# Altium schematic sheet rad_detector_v500_MAIN.SchDoc
size A4; SheetNumber: 1; SheetTotal: 7
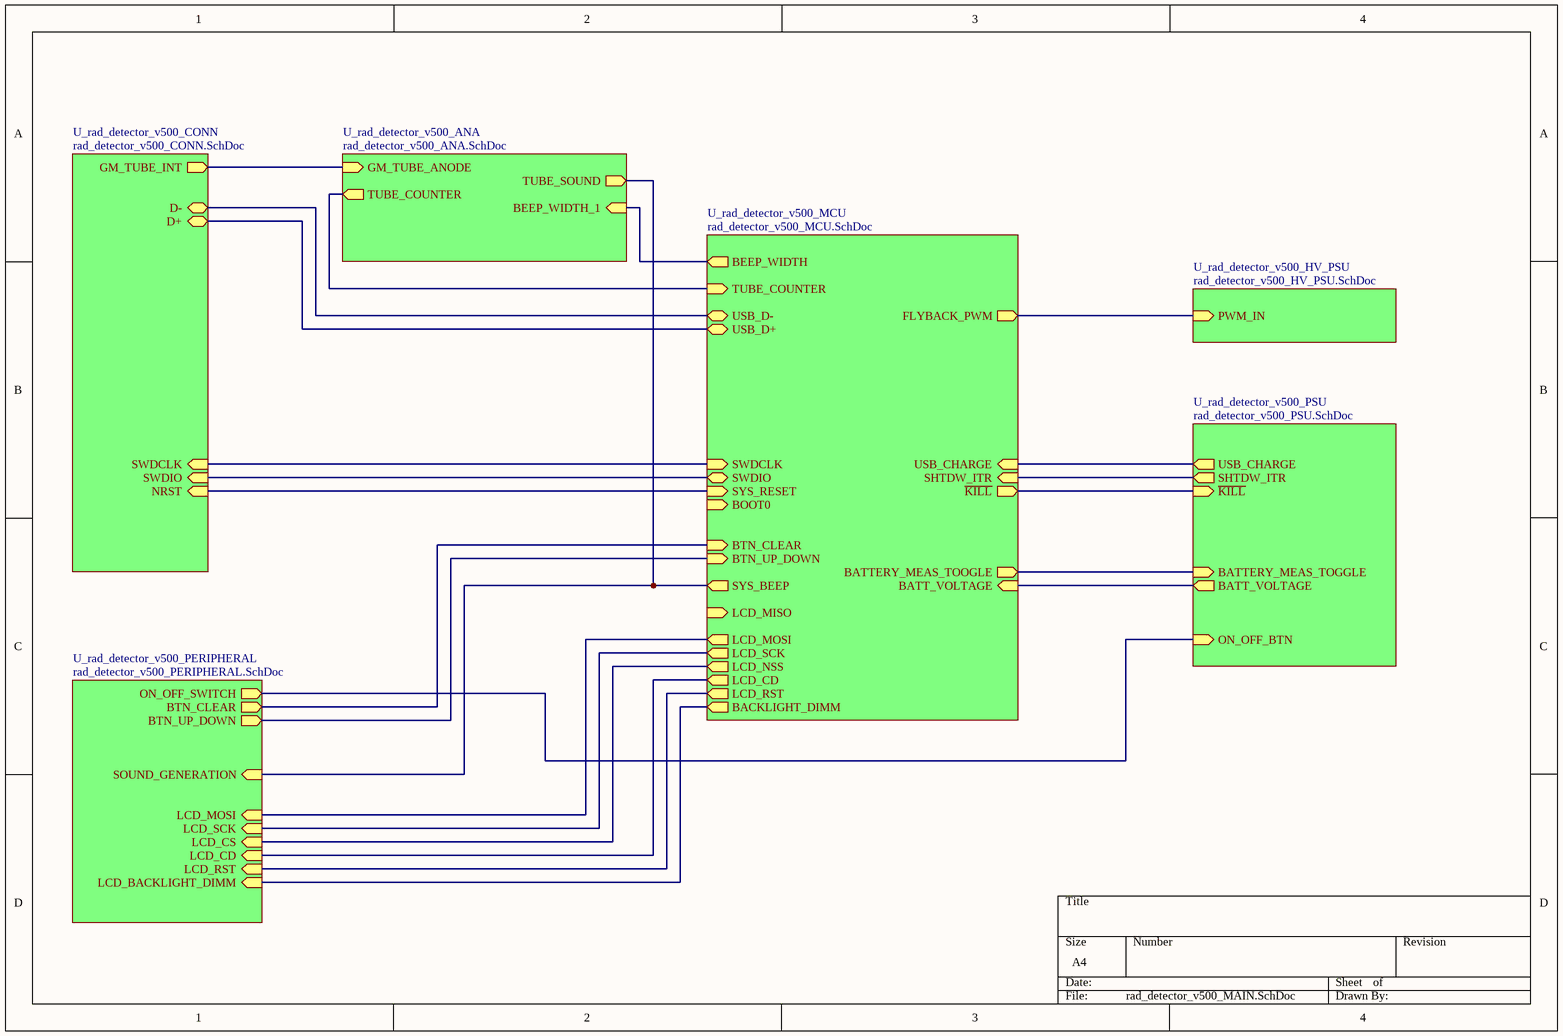
[diagram p0: rad_detector_v500_MAIN.SchDoc]

## Sub-sheets
U_rad_detector_v500_ANA = rad_detector_v500_ANA.SchDoc: GM_TUBE_ANODE (in), BEEP_WIDTH_1 (in), TUBE_COUNTER (out), TUBE_SOUND (out)
U_rad_detector_v500_CONN = rad_detector_v500_CONN.SchDoc: GM_TUBE_INT (out), D- (bidir), D+ (bidir), NRST (in), SWDCLK (in), SWDIO (in)
U_rad_detector_v500_HV_PSU = rad_detector_v500_HV_PSU.SchDoc: PWM_IN (in)
U_rad_detector_v500_MCU = rad_detector_v500_MCU.SchDoc: SYS_BEEP (out), BOOT0 (in), SYS_RESET (in), SWDIO (bidir), SWDCLK (in), USB_CHARGE (in), BATTERY_MEAS_TOOGLE (out), FLYBACK_PWM (out), SHTDW_ITR (in), TUBE_COUNTER (in), BACKLIGHT_DIMM (out), LCD_RST (out), LCD_MOSI (out), LCD_MISO (in), LCD_SCK (out), LCD_NSS (out), USB_D- (bidir), USB_D+ (bidir), BTN_CLEAR (in), BTN_UP_DOWN (in), BATT_VOLTAGE (in), BEEP_WIDTH (out), ~{KILL} (out), LCD_CD (out)
U_rad_detector_v500_PERIPHERAL = rad_detector_v500_PERIPHERAL.SchDoc: SOUND_GENERATION (in), LCD_BACKLIGHT_DIMM (in), LCD_MOSI (in), LCD_SCK (in), LCD_CS (in), LCD_CD (in), LCD_RST (in), ON_OFF_SWITCH (out), BTN_CLEAR (out), BTN_UP_DOWN (out)
U_rad_detector_v500_PSU = rad_detector_v500_PSU.SchDoc: ON_OFF_BTN (in), SHTDW_ITR (out), USB_CHARGE (out), BATTERY_MEAS_TOGGLE (in), BATT_VOLTAGE (out), ~{KILL} (in)

## Nets
(unnamed): sheet U_rad_detector_v500_CONN/GM_TUBE_INT, sheet U_rad_detector_v500_ANA/GM_TUBE_ANODE
(unnamed): sheet U_rad_detector_v500_CONN/D-, sheet U_rad_detector_v500_MCU/USB_D-
(unnamed): sheet U_rad_detector_v500_CONN/D+, sheet U_rad_detector_v500_MCU/USB_D+
(unnamed): sheet U_rad_detector_v500_CONN/NRST, sheet U_rad_detector_v500_MCU/SYS_RESET
(unnamed): sheet U_rad_detector_v500_CONN/SWDCLK, sheet U_rad_detector_v500_MCU/SWDCLK
(unnamed): sheet U_rad_detector_v500_CONN/SWDIO, sheet U_rad_detector_v500_MCU/SWDIO
(unnamed): sheet U_rad_detector_v500_PERIPHERAL/SOUND_GENERATION, sheet U_rad_detector_v500_ANA/TUBE_SOUND, sheet U_rad_detector_v500_MCU/SYS_BEEP
(unnamed): sheet U_rad_detector_v500_PERIPHERAL/LCD_BACKLIGHT_DIMM, sheet U_rad_detector_v500_MCU/BACKLIGHT_DIMM
(unnamed): sheet U_rad_detector_v500_PERIPHERAL/LCD_MOSI, sheet U_rad_detector_v500_MCU/LCD_MOSI
(unnamed): sheet U_rad_detector_v500_PERIPHERAL/LCD_SCK, sheet U_rad_detector_v500_MCU/LCD_SCK
(unnamed): sheet U_rad_detector_v500_PERIPHERAL/LCD_CS, sheet U_rad_detector_v500_MCU/LCD_NSS
(unnamed): sheet U_rad_detector_v500_PERIPHERAL/LCD_CD, sheet U_rad_detector_v500_MCU/LCD_CD
(unnamed): sheet U_rad_detector_v500_PERIPHERAL/LCD_RST, sheet U_rad_detector_v500_MCU/LCD_RST
(unnamed): sheet U_rad_detector_v500_PERIPHERAL/ON_OFF_SWITCH, sheet U_rad_detector_v500_PSU/ON_OFF_BTN
(unnamed): sheet U_rad_detector_v500_PERIPHERAL/BTN_CLEAR, sheet U_rad_detector_v500_MCU/BTN_CLEAR
(unnamed): sheet U_rad_detector_v500_PERIPHERAL/BTN_UP_DOWN, sheet U_rad_detector_v500_MCU/BTN_UP_DOWN
(unnamed): sheet U_rad_detector_v500_ANA/BEEP_WIDTH_1, sheet U_rad_detector_v500_MCU/BEEP_WIDTH
(unnamed): sheet U_rad_detector_v500_ANA/TUBE_COUNTER, sheet U_rad_detector_v500_MCU/TUBE_COUNTER
(unnamed): sheet U_rad_detector_v500_HV_PSU/PWM_IN, sheet U_rad_detector_v500_MCU/FLYBACK_PWM
(unnamed): sheet U_rad_detector_v500_PSU/SHTDW_ITR, sheet U_rad_detector_v500_MCU/SHTDW_ITR
(unnamed): sheet U_rad_detector_v500_PSU/USB_CHARGE, sheet U_rad_detector_v500_MCU/USB_CHARGE
(unnamed): sheet U_rad_detector_v500_PSU/BATTERY_MEAS_TOGGLE, sheet U_rad_detector_v500_MCU/BATTERY_MEAS_TOOGLE
(unnamed): sheet U_rad_detector_v500_PSU/BATT_VOLTAGE, sheet U_rad_detector_v500_MCU/BATT_VOLTAGE
(unnamed): sheet U_rad_detector_v500_PSU/~{KILL}, sheet U_rad_detector_v500_MCU/~{KILL}